# EAGLE schematic Workbench Safety ATTINY Watchdog (EAGLE 8.7.1)
AUTHOR: K McNicoll; REV: 1.1

## Sheet 1 of 3
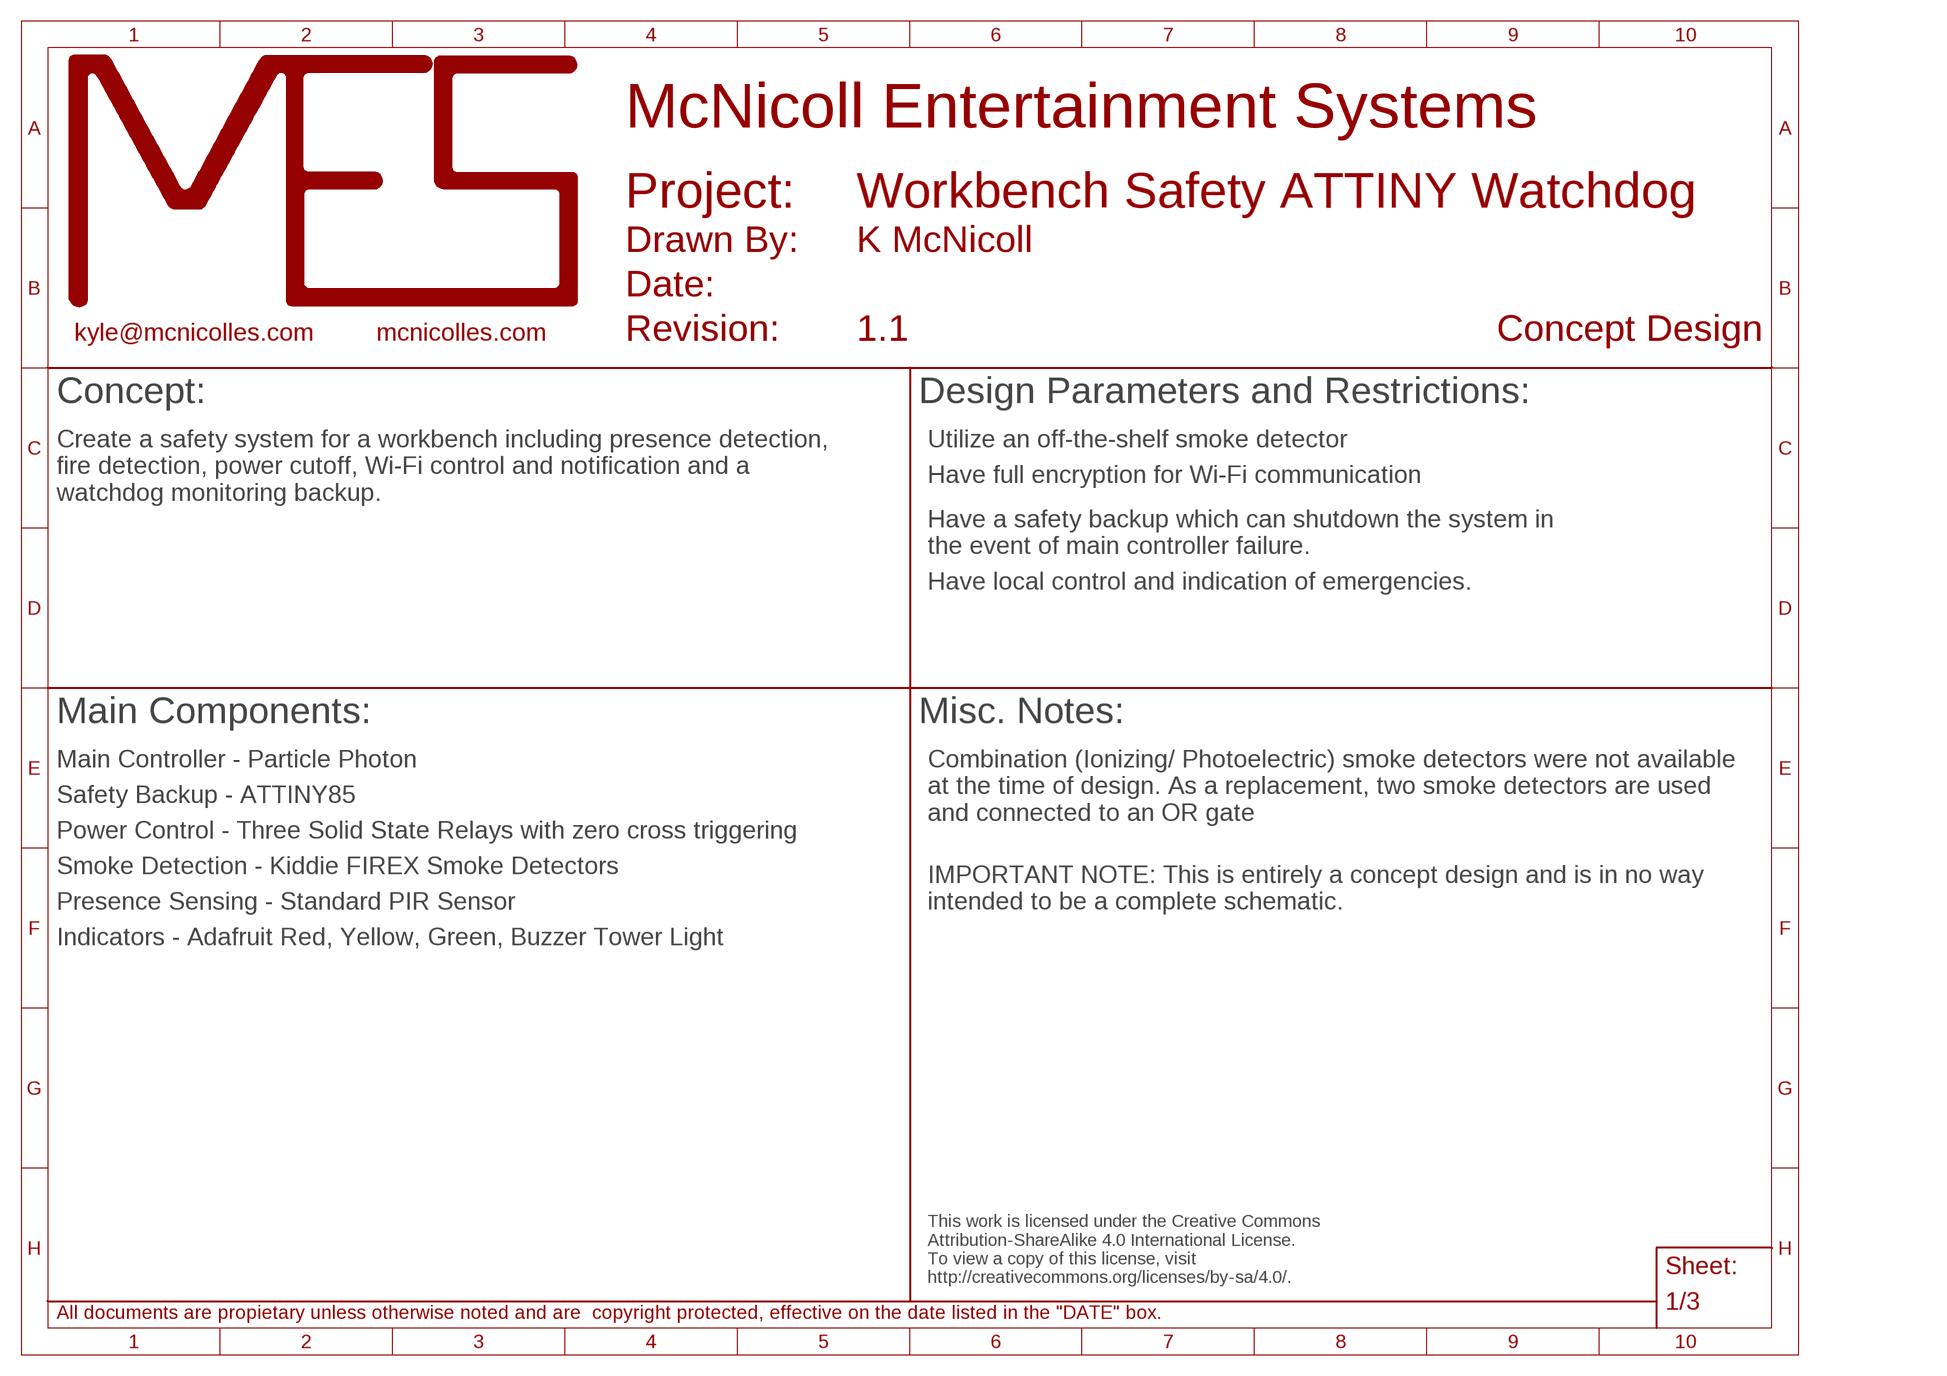
[diagram p0: schematic, sheet 1]
FRAME1 (LETTER_L_COVER): NOTATION: Concept Design

### Notes on the sheet
- Utilize an off-the-shelf smoke detector
- Have full encryption for Wi-Fi communication
- Create a safety system for a workbench including presence detection,
  fire detection, power cutoff, Wi-Fi control and notification and a 
  watchdog monitoring backup.
- Have a safety backup which can shutdown the system in
  the event of main controller failure.
- Have local control and indication of emergencies.
- Main Controller - Particle Photon
- Safety Backup - ATTINY85
- Combination (Ionizing/ Photoelectric) smoke detectors were not available
  at the time of design. As a replacement, two smoke detectors are used
  and connected to an OR gate
- Power Control - Three Solid State Relays with zero cross triggering
- Smoke Detection - Kiddie FIREX Smoke Detectors
- Presence Sensing - Standard PIR Sensor
- IMPORTANT NOTE: This is entirely a concept design and is in no way
  intended to be a complete schematic.
- Indicators - Adafruit Red, Yellow, Green, Buzzer Tower Light
- This work is licensed under the Creative Commons
  Attribution-ShareAlike 4.0 International License.
  To view a copy of this license, visit
  http://creativecommons.org/licenses/by-sa/4.0/.

## Sheet 2 of 3
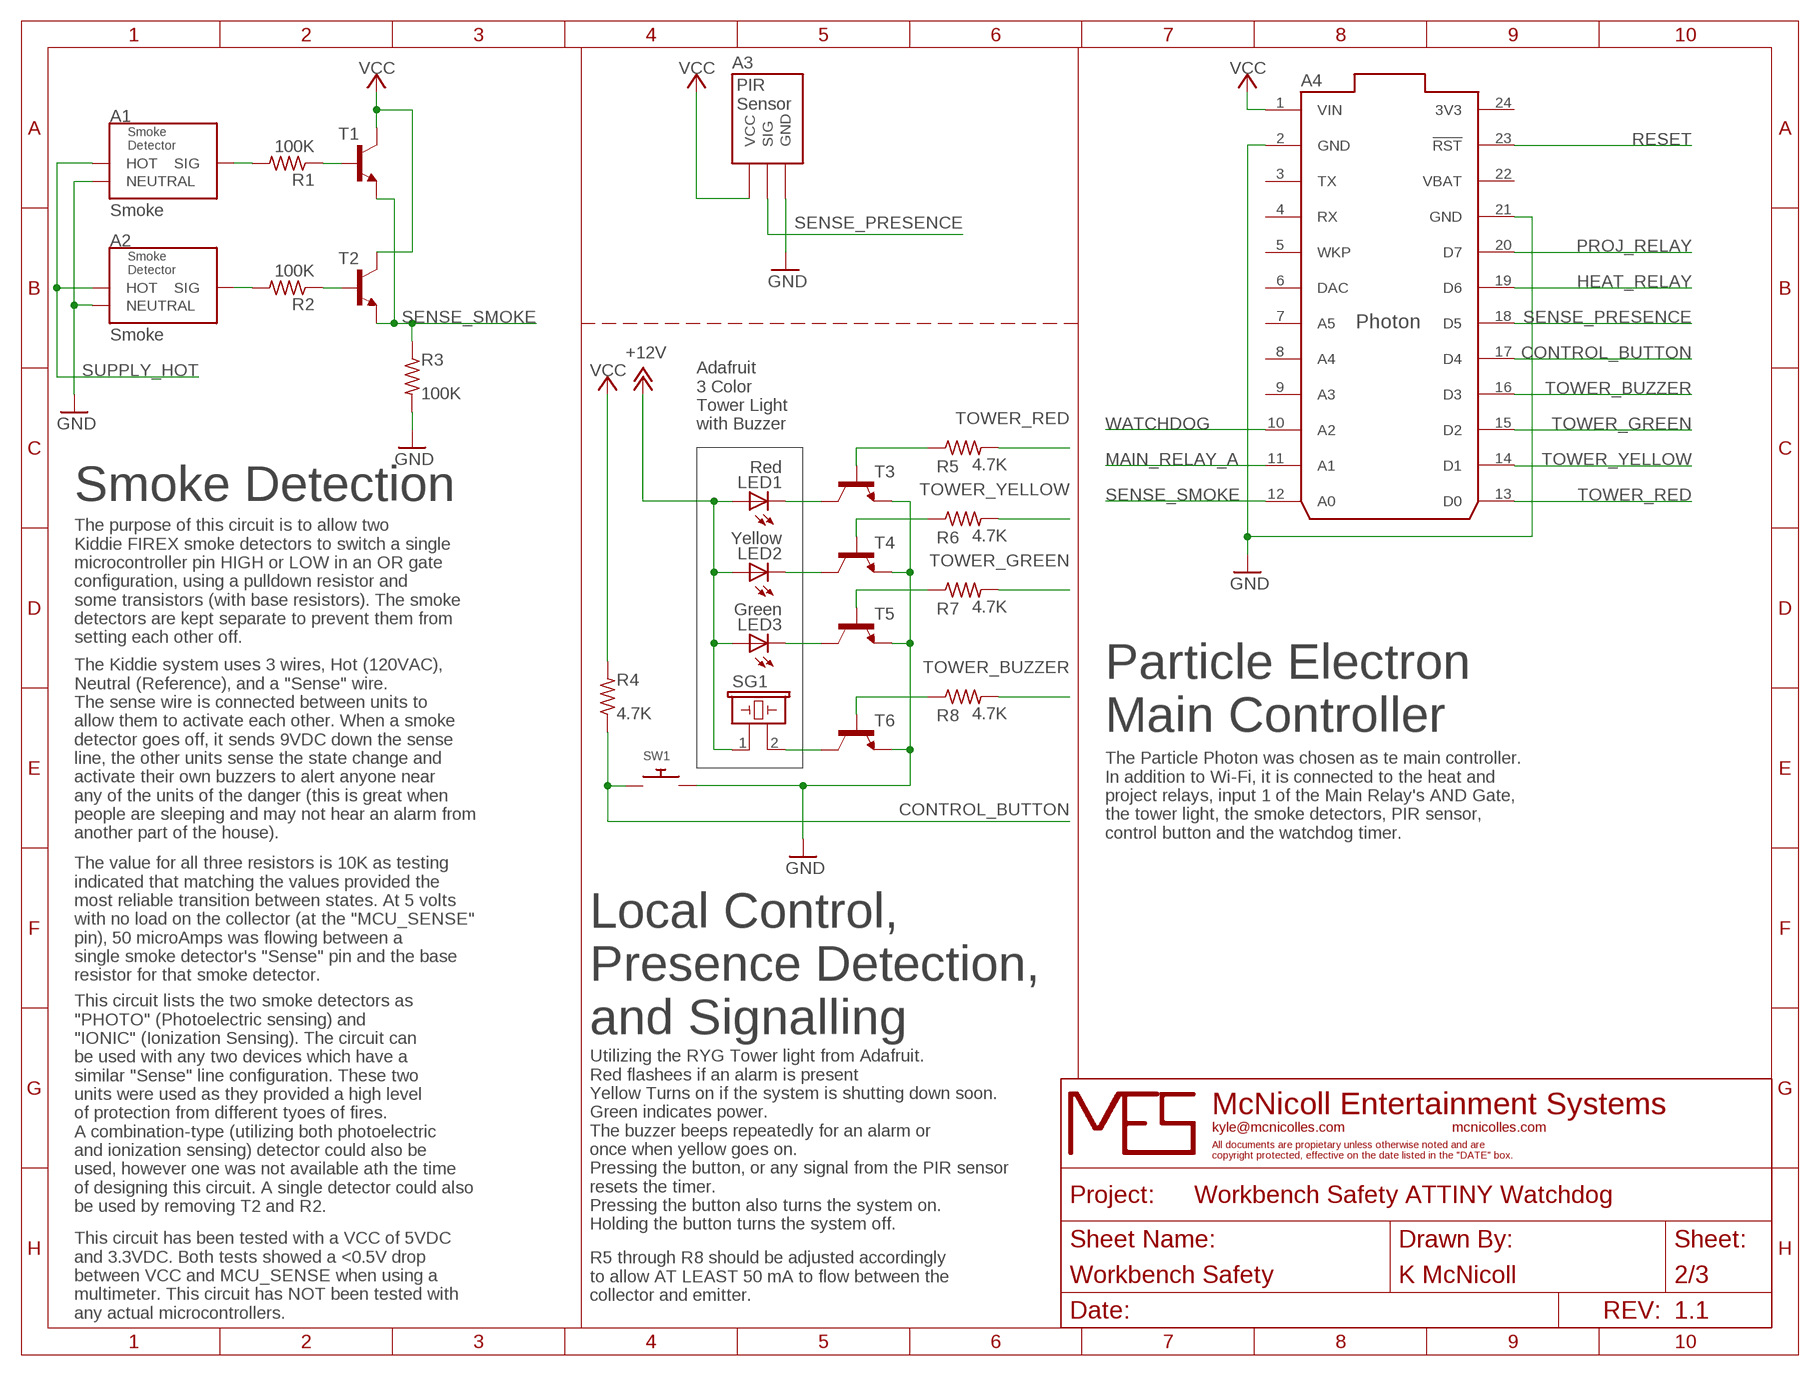
[diagram p1: schematic, sheet 2]
FRAME2 (LETTER_L): SHEET_NAME: Workbench Safety

### Parts
A1  Smoke  FIREX_SMOKE_DETECTOR  (no package)
A2  Smoke  FIREX_SMOKE_DETECTOR  (no package)
A3  PIR_SENSOR  (no package)
A4  PHOTON_WITH_HEADERS  [PHOTON]
LED1  Red  LED5MM  [LED5MM]
LED2  Yellow  LED5MM  [LED5MM]
LED3  Green  LED5MM  [LED5MM]
R1  100K  R-US_0204/5  [0204/5]
R2  100K  R-US_0204/5  [0204/5]
R3  100K  R-US_0204/5  [0204/5]
R4  4.7K  R-US_0204/5  [0204/5]
R5  4.7K  R-US_0204/5  [0204/5]
R6  4.7K  R-US_0204/5  [0204/5]
R7  4.7K  R-US_0204/5  [0204/5]
R8  4.7K  R-US_0204/5  [0204/5]
SG1  B/C11L  [B/C11L]
SW1  SWITCH_PUSHBUTTONEVQ-PE  [TACT_PANA-EVQ]
T1  2N2222  [TO18]
T2  2N2222  [TO18]
T3  2N2222  [TO92-EBC-OVAL]
T4  2N2222  [TO92-EBC-OVAL]
T5  2N2222  [TO92-EBC-OVAL]
T6  2N2222  [TO92-EBC-OVAL]

### Nets
+12V: LED1.A LED2.A LED3.A SG1.1
CONTROL_BUTTON: A4.17(D4) R4.1 SW1.P$1
GND: A1.NEUTRAL A2.NEUTRAL A3.GND A4.2(GND) A4.21(GND) R3.2 SW1.P$2 T3.E T4.E T5.E T6.E ; also sheet 3
HEAT_RELAY: A4.19(D6) ; also sheet 3
MAIN_RELAY_A: A4.11(A1) ; also sheet 3
N$1: R8.1 T6.B
N$2: R1.1 T1.2(B)
N$3: R2.1 T2.2(B)
N$6: SG1.2 T6.C
N$7: LED3.K(C) T5.C
N$8: LED2.K(C) T4.C
N$9: LED1.K(C) T3.C
N$10: R7.1 T5.B
N$11: R6.1 T4.B
N$12: R5.1 T3.B
N$13: A1.SIG R1.2
N$14: A2.SIG R2.2
PROJ_RELAY: A4.20(D7) ; also sheet 3
RESET: A4.23(!RST) ; also sheet 3
SENSE_PRESENCE: A3.SIG A4.18(D5)
SENSE_SMOKE: A4.12(A0) R3.1 T1.1(E) T2.1(E) ; also sheet 3
SUPPLY_HOT: A1.HOT A2.HOT ; also sheet 3
TOWER_BUZZER: A4.16(D3) R8.2
TOWER_GREEN: A4.15(D2) R7.2
TOWER_RED: A4.13(D0) R5.2
TOWER_YELLOW: A4.14(D1) R6.2
VCC: A3.VCC A4.1(VIN) R4.2 T1.3(C) T2.3(C) ; also sheet 3
WATCHDOG: A4.10(A2) ; also sheet 3
Unconnected: A4.3(TX) A4.4(RX) A4.5(WKP) A4.6(DAC) A4.7(A5) A4.8(A4) A4.9(A3)

### Notes on the sheet
- Adafruit
  3 Color
  Tower Light
  with Buzzer
- Smoke Detection
- The purpose of this circuit is to allow two
  Kiddie FIREX smoke detectors to switch a single
  microcontroller pin HIGH or LOW in an OR gate
  configuration, using a pulldown resistor and 
  some transistors (with base resistors). The smoke
  detectors are kept separate to prevent them from
  setting each other off.
- Particle Electron
  Main Controller
- The Kiddie system uses 3 wires, Hot (120VAC),
  Neutral (Reference), and a "Sense" wire.
  The sense wire is connected between units to
  allow them to activate each other. When a smoke
  detector goes off, it sends 9VDC down the sense
  line, the other units sense the state change and
  activate their own buzzers to alert anyone near
  any of the units of the danger (this is great when
  people are sleeping and may not hear an alarm from
  another part of the house).
- The Particle Photon was chosen as te main controller.
  In addition to Wi-Fi, it is connected to the heat and
  project relays, input 1 of the Main Relay's AND Gate,
  the tower light, the smoke detectors, PIR sensor,
  control button and the watchdog timer.
- The value for all three resistors is 10K as testing
  indicated that matching the values provided the
  most reliable transition between states. At 5 volts
  with no load on the collector (at the "MCU_SENSE"
  pin), 50 microAmps was flowing between a
  single smoke detector's "Sense" pin and the base
  resistor for that smoke detector.
- Local Control,
  Presence Detection,
  and Signalling
- This circuit lists the two smoke detectors as
  "PHOTO" (Photoelectric sensing) and
  "IONIC" (Ionization Sensing). The circuit can
  be used with any two devices which have a
  similar "Sense" line configuration. These two
  units were used as they provided a high level
  of protection from different tyoes of fires.
  A combination-type (utilizing both photoelectric
  and ionization sensing) detector could also be
  used, however one was not available ath the time
  of designing this circuit. A single detector could also
  be used by removing T2 and R2.
- Utilizing the RYG Tower light from Adafruit.
  Red flashees if an alarm is present
  Yellow Turns on if the system is shutting down soon.
  Green indicates power.
  The buzzer beeps repeatedly for an alarm or
  once when yellow goes on.
  Pressing the button, or any signal from the PIR sensor
  resets the timer.
  Pressing the button also turns the system on.
  Holding the button turns the system off.
- R5 through R8 should be adjusted accordingly
  to allow AT LEAST 50 mA to flow between the
  collector and emitter.
- This circuit has been tested with a VCC of 5VDC
  and 3.3VDC. Both tests showed a <0.5V drop
  between VCC and MCU_SENSE when using a
  multimeter. This circuit has NOT been tested with
  any actual microcontrollers.

## Sheet 3 of 3
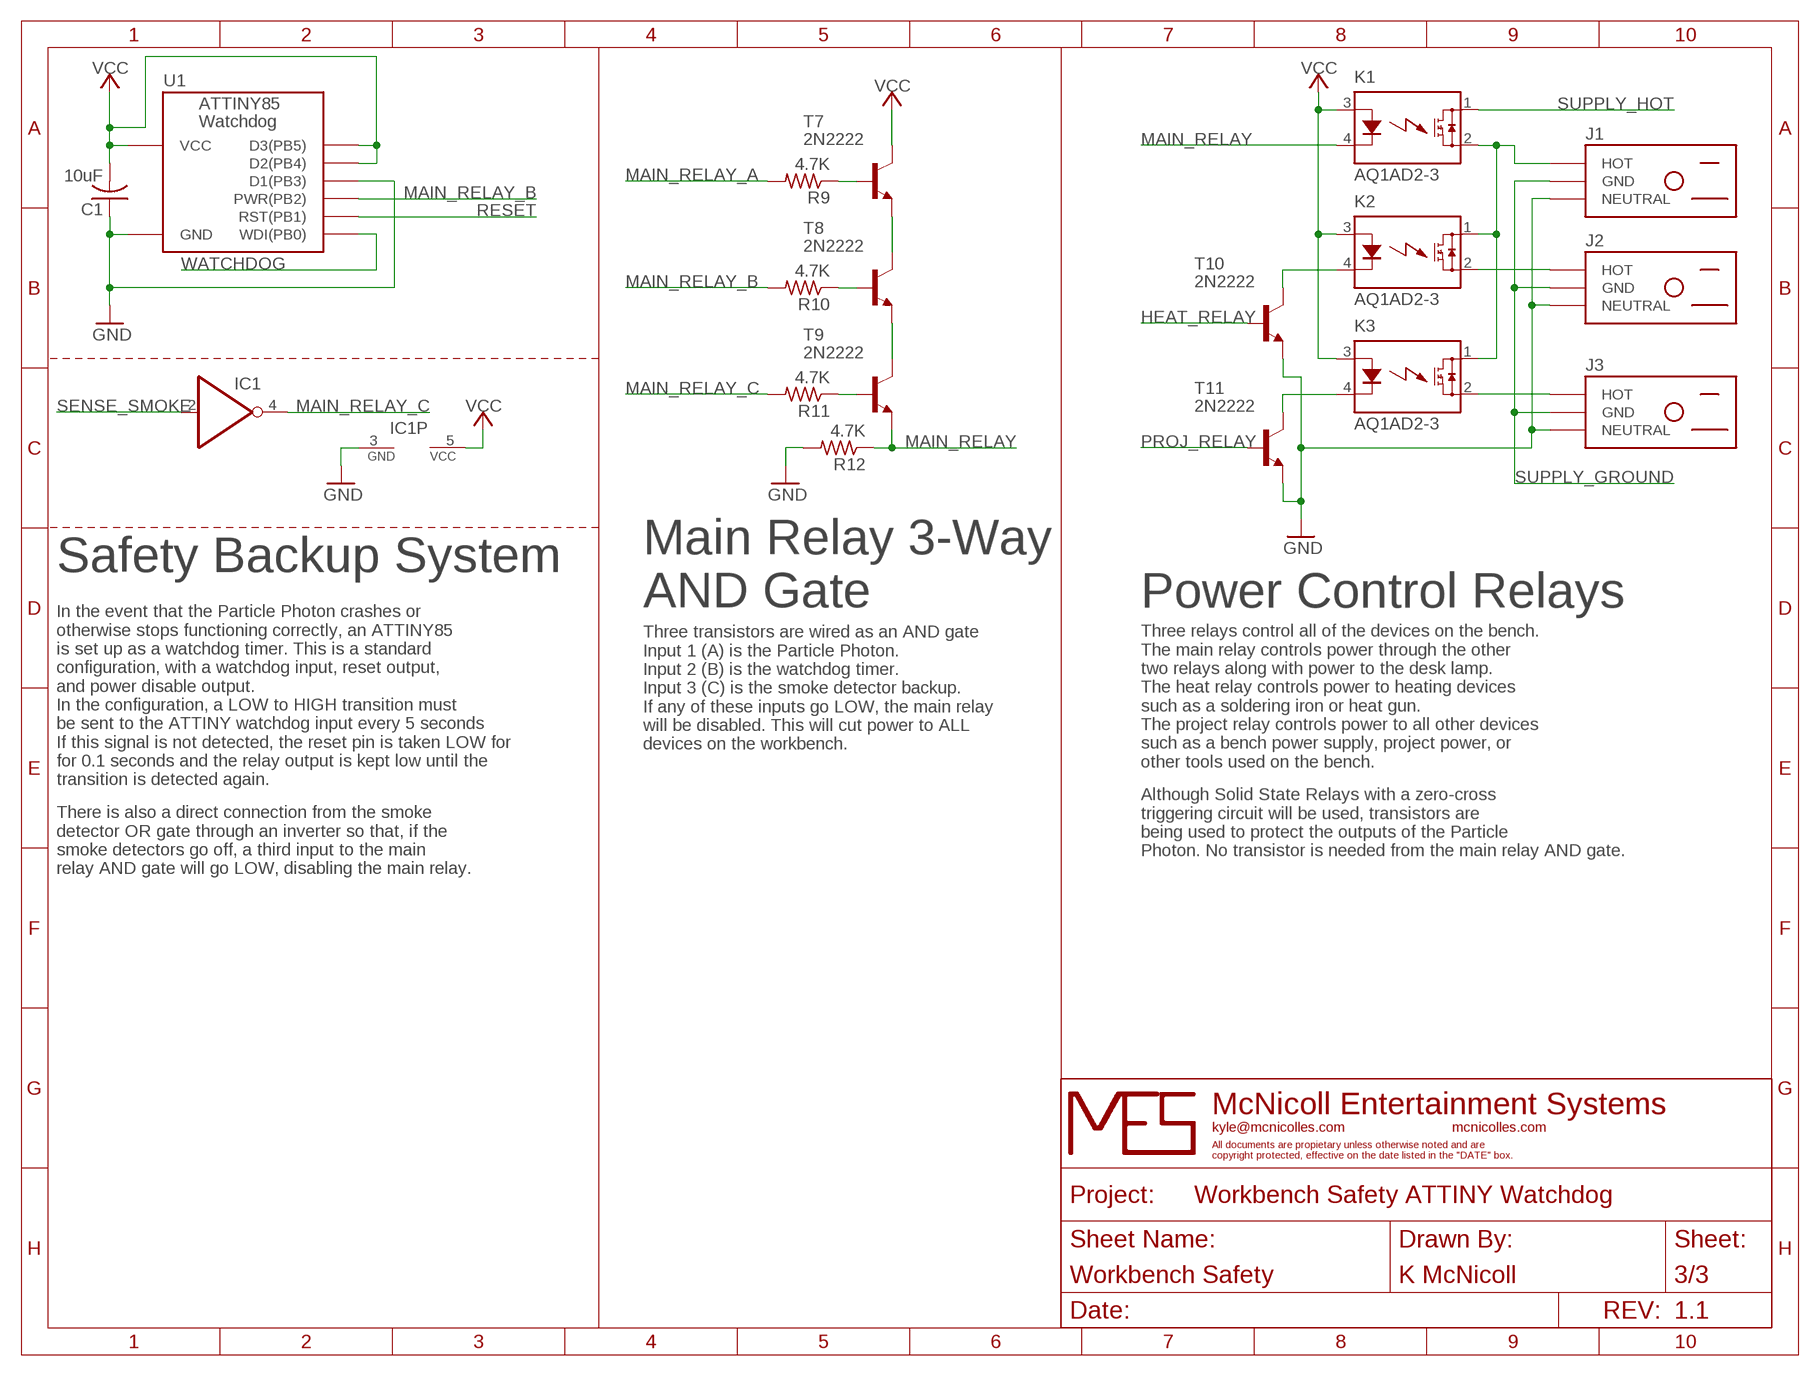
[diagram p2: schematic, sheet 3]
FRAME3 (LETTER_L): SHEET_NAME: Workbench Safety

### Parts
C1  10uF  C-US025-025X050  [C025-025X050]
IC1  74AHC1G04DBV  [SOT23-5]
J1  AC_OUTLET  (no package)
J2  AC_OUTLET  (no package)
J3  AC_OUTLET  (no package)
K1  AQ1AD2-3  [AQ1]
K2  AQ1AD2-3  [AQ1]
K3  AQ1AD2-3  [AQ1]
R9  4.7K  R-US_0204/5  [0204/5]
R10  4.7K  R-US_0204/5  [0204/5]
R11  4.7K  R-US_0204/5  [0204/5]
R12  4.7K  R-US_0204/5  [0204/5]
T7  2N2222  [TO18]
T8  2N2222  [TO18]
T9  2N2222  [TO18]
T10  2N2222  [TO18]
T11  2N2222  [TO18]
U1  ATTINY85-WD  (no package)

### Nets
GND: C1.1 IC1.3(GND) J1.NEUTRAL J2.NEUTRAL J3.NEUTRAL R12.2 T10.1(E) T11.1(E) U1.D1(PB3) U1.GND ; also sheet 2
HEAT_RELAY: T10.2(B) ; also sheet 2
MAIN_RELAY: K1.4(K) R12.1 T9.1(E)
MAIN_RELAY_A: R9.2 ; also sheet 2
MAIN_RELAY_B: R10.2 U1.PWR(PB2)
MAIN_RELAY_C: IC1.4(O) R11.2
N$18: R11.1 T9.2(B)
N$19: R10.1 T8.2(B)
N$20: K2.4(K) T10.3(C)
N$21: K3.4(K) T11.3(C)
N$22: J1.HOT K1.2(DS2) K2.1(DS1) K3.1(DS1)
N$24: R9.1 T7.2(B)
N$25: J2.HOT K2.2(DS2)
N$26: J3.HOT K3.2(DS2)
N$27: T7.1(E) T8.3(C)
N$28: T8.1(E) T9.3(C)
PROJ_RELAY: T11.2(B) ; also sheet 2
RESET: U1.RST(PB1) ; also sheet 2
SENSE_SMOKE: IC1.2(I) ; also sheet 2
SUPPLY_GROUND: J1.GND J2.GND J3.GND
SUPPLY_HOT: K1.1(DS1) ; also sheet 2
VCC: C1.2 IC1.5(VCC) K1.3(A) K2.3(A) K3.3(A) T7.3(C) U1.D2(PB4) U1.D3(PB5) U1.VCC ; also sheet 2
WATCHDOG: U1.WDI(PB0) ; also sheet 2

### Notes on the sheet
- Safety Backup System
- Main Relay 3-Way
  AND Gate
- Power Control Relays
- Three transistors are wired as an AND gate
  Input 1 (A) is the Particle Photon.
  Input 2 (B) is the watchdog timer.
  Input 3 (C) is the smoke detector backup.
  If any of these inputs go LOW, the main relay
  will be disabled. This will cut power to ALL
  devices on the workbench.
- Three relays control all of the devices on the bench.
  The main relay controls power through the other
  two relays along with power to the desk lamp.
  The heat relay controls power to heating devices
  such as a soldering iron or heat gun.
  The project relay controls power to all other devices
  such as a bench power supply, project power, or
  other tools used on the bench.
- In the event that the Particle Photon crashes or
  otherwise stops functioning correctly, an ATTINY85
  is set up as a watchdog timer. This is a standard
  configuration, with a watchdog input, reset output,
  and power disable output.
  In the configuration, a LOW to HIGH transition must
  be sent to the ATTINY watchdog input every 5 seconds
  If this signal is not detected, the reset pin is taken LOW for
  for 0.1 seconds and the relay output is kept low until the
  transition is detected again.
- Although Solid State Relays with a zero-cross
  triggering circuit will be used, transistors are
  being used to protect the outputs of the Particle
  Photon. No transistor is needed from the main relay AND gate.
- There is also a direct connection from the smoke
  detector OR gate through an inverter so that, if the
  smoke detectors go off, a third input to the main
  relay AND gate will go LOW, disabling the main relay.

## Power pins joined to a net without a drawn wire
3V3: A4.24(3V3)
VBAT: A4.22(VBAT)

## Library data of the parts
A1 A2 = Custom:FIREX_SMOKE_DETECTOR
A3 = Custom:PIR_SENSOR
A4 = Particle:PHOTON
C1 = adafruit:C-US: CAPACITOR, American symbol
IC1 = 74xx-little-de:74*1G04: INVERTER Gate
J1-J3 = Custom:AC_OUTLET
K1-K3 = relay:AQ*: SOLID STATE RELAY NAiS Source: http://www.mew-europe.com/.. en_ds_61601_0000.pdf; MF: AROMAT/ MATSUSHITA; MPN: AQ1AD2-3/28VDC; OC_FARNELL: unknown; OC_NEWARK: 10C4052
LED1-LED3 = adafruit:LED: LED OSRAM: - CHIPLED LG R971, LG N971, LY N971, LG Q971, LY Q971, LO R971, LY R971 LH N974, LH R974 LS Q976, LO Q976, LY Q976 LO Q996 - Hyper CHIPLED LW Q18S LB Q993, LB Q99A, LB R99A - SideLED LS A670, LO A670, LY A670, LG A670, LP A670 LB A673, LV A673, LT A673, LW A673 LH A674 LY A675 LS A676, LA A676, LO A676, LY A676, LW A676 LS A679, LY A679, LG A679 - Hyper Micro SIDELED® LS Y876, LA Y876, LO Y876, LY Y876 LT Y87S - SmartLED LW L88C, LW L88S LB L89C, LB L89S, LG L890 LS L89K, LO L89K, LY L89K LS L896, LA L896, LO L896, LY L896 - TOPLED LS T670, LO T670, LY T670, LG T670, LP T670 LSG T670, LSP T670, LSY T670, LOP T670, LYG T670 LG T671, LOG T671, LSG T671 LB T673, LV T673, LT T673, LW T673 LH T674 LS T676, LA T676, LO T676, LY T676, LB T676, LH T676, LSB T676, LW T676 LB T67C, LV T67C, LT T67C, LS T67K, LO T67K, LY T67K, LW E67C LS E67B, LA E67B, LO E67B, LY E67B, LB E67C, LV E67C, LT E67C LW T67C LS T679, LY T679, LG T679 LS T770, LO T770, LY T770, LG T770, LP T770 LB T773, LV T773, LT T773, LW T773 LH T774 LS E675, LA E675, LY E675, LS T675 LS T776, LA T776, LO T776, LY T776, LB T776 LHGB T686 LT T68C, LB T68C - Hyper Mini TOPLED® LB M676 - Mini TOPLED Santana® LG M470 LS M47K, LO M47K, LY M47K Source: http://www.osram.convergy.de/
R1-R12 = adafruit:R-US_: RESISTOR, American symbol
SG1 = buzzer:B/C11L: BUZZER Source: Buerklin; OC_FARNELL: unknown; OC_NEWARK: unknown
SW1 = adafruit:SWITCH_PUSHBUTTON: Buttons SOFTTOUCHSMD_SJ - Soft touch temporary push button (Super Junk Akihabara) Compatible with SKPMANE010 [Mouser: 688-SKPMAN] C&K_KSS = Digikey: KSS221GLFS
T1 T2 T7-T11 = transistor:2N2222: NPN TRANSISTOR Big oval pads
T3-T6 = adafruit:2N2222: NPN TRANSISTOR Big oval pads
U1 = Custom:ATTINY85-WD